# EAGLE design SensorPlatine (EAGLE 6.6.0)
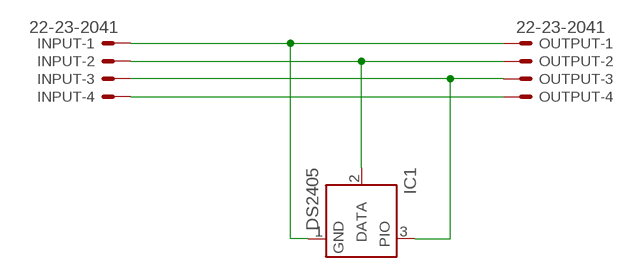
[diagram p0: schematic, sheet 1]

## Parts
IC1  DS2405  [TO92-]
INPUT  22-23-2041  [22-23-2041]
OUTPUT  22-23-2041  [22-23-2041]

## Nets
DATA: IC1.2(DATA) INPUT.2 OUTPUT.2
GND: IC1.1(GND) INPUT.1 OUTPUT.1
N$2: IC1.3(PIO) INPUT.3 OUTPUT.3
RESERVED: INPUT.4 OUTPUT.4

## Library data of the parts
IC1 = maxim:DS2405: Addressable Switch DALLAS Semiconductor; MF: DALLAS SEMICONDUCTOR; MPN: DS2405; OC_FARNELL: 1188025; OC_NEWARK: 06F4645
INPUT OUTPUT = con-molex:22-23-2041: .100" (2.54mm) Center Header - 4 Pin; MF: MOLEX; MPN: 22-23-2041; OC_FARNELL: 1462920; OC_NEWARK: 38C0355

## Board
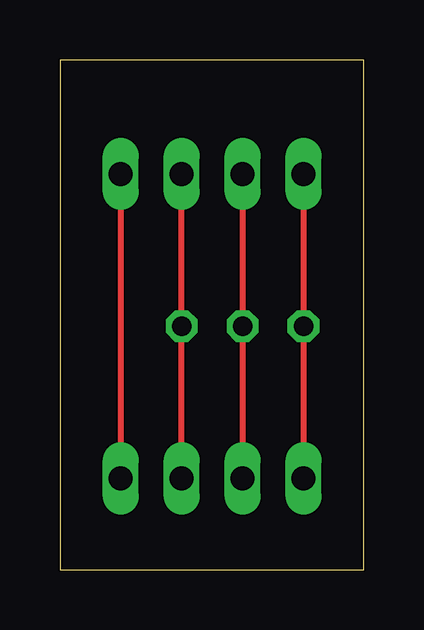
[diagram p1: board, top side]
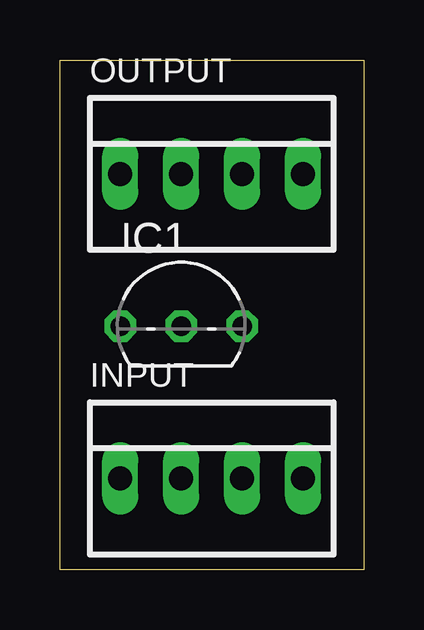
[diagram p2: board, bottom side, seen from below]

Size 12.68 x 21.26 mm. Coordinates in mm from the lower left corner, seen from the top.
Outline: 0,0 12.68,0 12.68,21.26 0,21.26 0,0
Copper layers (1*16): Top 0.035mm / dielectric 1.5mm / Bottom 0.035mm
Design rules "default": minimum track width 10mil, minimum drill 24mil, track to track 8mil, track to pad 8mil, pad to pad 8mil, via to via 8mil, smd to smd 8mil, copper to edge 40mil, drill to drill 8mil, minimum pad ring 10mil, minimum via ring 8mil, stop-mask expansion 4mil, vias tented up to drill 0mil, thermal gap 10mil

### Footprints (pad centres in the part's own frame; a part is rotated, then mirrored left to right if it is on the bottom)
TO92- = drill 0.813 octagon: 1 -2.54,0; 2 0,0; 3 2.54,0
22-23-2041 = drill 1 long: 1 -3.81,0; 2 -1.27,0; 3 1.27,0; 4 3.81,0

### Placement (x,y rotation side)
IC1  7.62,10.16 0 bottom
INPUT  6.35,3.81 0 bottom
OUTPUT  6.35,16.51 0 bottom

### Tracks (layer width: path | path; a pad name or v marks a point on that pad's centre or on a via)
DATA
  Top 0.254: OUTPUT.2 IC1.2 INPUT.2
GND
  Top 0.254: OUTPUT.1 IC1.1 INPUT.1
N$2
  Top 0.254: INPUT.3 IC1.3 OUTPUT.3
RESERVED
  Top 0.254: OUTPUT.4 INPUT.4

### Text on the board
_bNames: OUTPUT | IC1 | INPUT